# Altium schematic sheet Sheet1.SchDoc
size A4
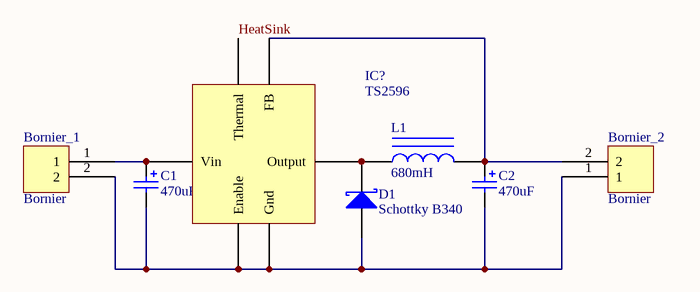
[diagram p0: Sheet1.SchDoc]

## Parts
Bornier_1  Bornier  [Bornier]
Bornier_2  Bornier  [Bornier]
C1  470uF  [Capa_pol1]
C2  470uF  [Capa_pol1]
D1  Schottky B340  [SMC]
IC?  TS2596  [TO263-5L]
L1  Valeur: 680mH  [self]  (hidden comment: Inductance)

## Nets
HeatSink: IC?.0(Thermal)
NetBornier_1_1: Bornier_1.1 C1.1 IC?.1(Vin)
NetBornier_1_2: Bornier_1.2 Bornier_2.1 C1.2 C2.2 D1.1(A) IC?.3(Gnd) IC?.5(Enable)
NetBornier_2_2: Bornier_2.2 C2.1 IC?.4(FB) L1.2
NetD1_2: D1.2(K) IC?.2(Output) L1.1

## Library data of the parts
Bornier_1 Bornier_2 = Bornier2
C1 C2 = Capa Pol